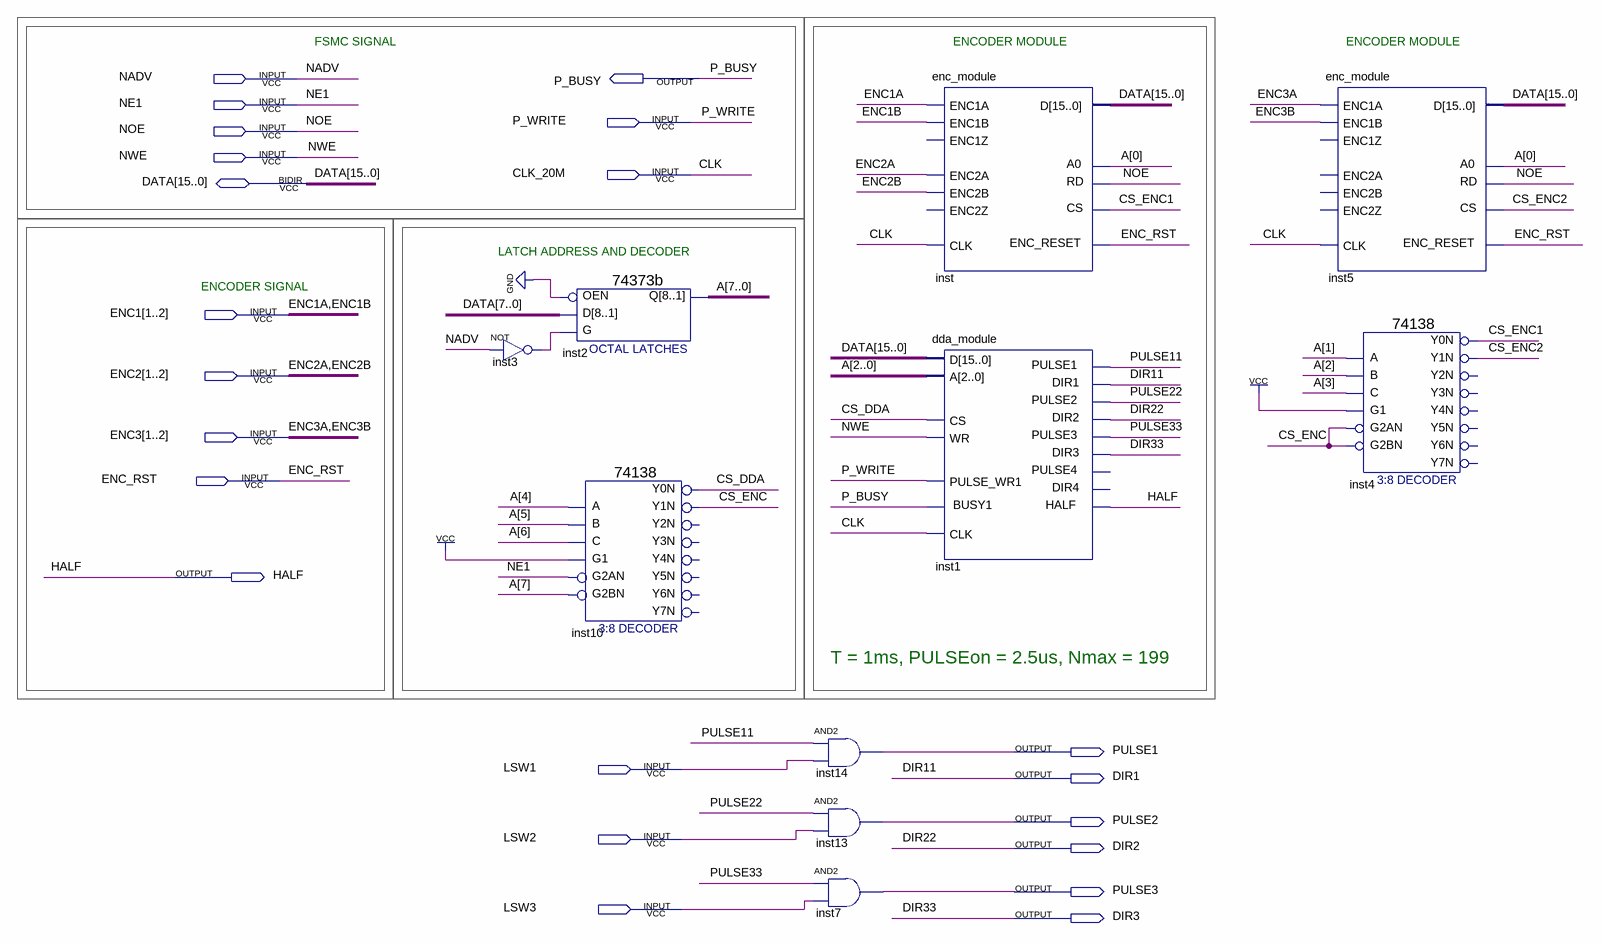
[diagram p0: schematic sheet]
// Quartus schematic read_encoder.bdf as structural Verilog: 10 symbols, 22 pins
module read_encoder (
  input  NADV,
  input  NE1,
  input  P_WRITE,
  input  NOE,
  input  NWE,
  input  CLK_20M,
  input  [1:2] ENC1,
  input  [1:2] ENC2,
  input  [1:2] ENC3,
  input  ENC_RST,
  input  LSW1,
  input  LSW2,
  input  LSW3,
  inout  [15:0] DATA,
  output P_BUSY,
  output HALF,
  output PULSE1,
  output DIR1,
  output PULSE2,
  output DIR2,
  output PULSE3,
  output DIR3
);

  wire CS_DDA, CS_ENC, CS_ENC1, CS_ENC2, inst3_out, PULSE11, PULSE22, PULSE33;
  wire [7:0] A;

  not inst3 (inst3_out, NADV);
  \74373b  inst2 (.D(DATA[7:0]), .G(inst3_out), .OEN(1'b0), .Q(A));
  \74138  inst10 (
    .A(A[4]), .B(A[5]), .G1(1'b1), .C(A[6]), .G2AN(NE1), .G2BN(A[7]), .Y0N(CS_DDA), .Y1N(CS_ENC));  // open: Y2N, Y3N, Y4N, Y5N, Y6N, Y7N
  and inst14 (PULSE1, PULSE11, LSW1);
  and inst13 (PULSE2, PULSE22, LSW2);
  and inst7 (PULSE3, PULSE33, LSW3);
  enc_module inst (
    .ENC_RESET(ENC_RST), .ENC1A(ENC1[1]), .ENC1B(ENC1[2]), .ENC2A(ENC2[1]), .ENC2B(ENC2[2]), .CLK(CLK_20M),
    .A0(A[0]), .CS(CS_ENC1), .RD(NOE), .D(DATA));  // open: ENC1Z, ENC2Z
  dda_module inst1 (
    .PULSE_WR1(P_WRITE), .D(DATA), .A(A[2:0]), .CS(CS_DDA), .WR(NWE), .CLK(CLK_20M), .BUSY1(P_BUSY),
    .PULSE1(PULSE11), .DIR1(DIR1), .PULSE2(PULSE22), .DIR2(DIR2), .PULSE3(PULSE33), .DIR3(DIR3), .HALF(HALF));  // open: PULSE4, DIR4
  enc_module inst5 (
    .ENC_RESET(ENC_RST), .ENC1A(ENC3[1]), .ENC1B(ENC3[2]), .CLK(CLK_20M), .A0(A[0]), .CS(CS_ENC2), .RD(NOE),
    .D(DATA));  // open: ENC1Z, ENC2A, ENC2B, ENC2Z
  \74138  inst4 (
    .A(A[1]), .B(A[2]), .G1(1'b1), .C(A[3]), .G2AN(CS_ENC), .G2BN(CS_ENC), .Y0N(CS_ENC1), .Y1N(CS_ENC2));  // open: Y2N, Y3N, Y4N, Y5N, Y6N, Y7N

  // Other names for the same wires on the sheet: CLK = CLK_20M; DIR11 = DIR1; DIR22 = DIR2; DIR33 = DIR3;
  //   ENC1A = ENC1[1]; ENC1B = ENC1[2]; ENC2A = ENC2[1]; ENC2B = ENC2[2]; ENC3A = ENC3[1]; ENC3B = ENC3[2]

  // Notes on the sheet:
  //   FSMC SIGNAL
  //   ENCODER MODULE
  //   ENCODER MODULE
  //   LATCH ADDRESS AND DECODER
  //   ENCODER SIGNAL
  //   T = 1ms, PULSEon = 2.5us, Nmax = 199
endmodule
